# Altium schematic sheet ADC_Signal_Distribution.SchDoc
size A4; CompanyName: Technische Hochschule Nürnberg Georg Simon Ohm; Organization: UltraZohm; Address1: Kesslerplatz 12; Address2: 90489 Nürnberg; Address3: GERMANY; DocumentNumber: 8; SheetNumber: 8; SheetTotal: 12; Website: www.ultrazohm.com
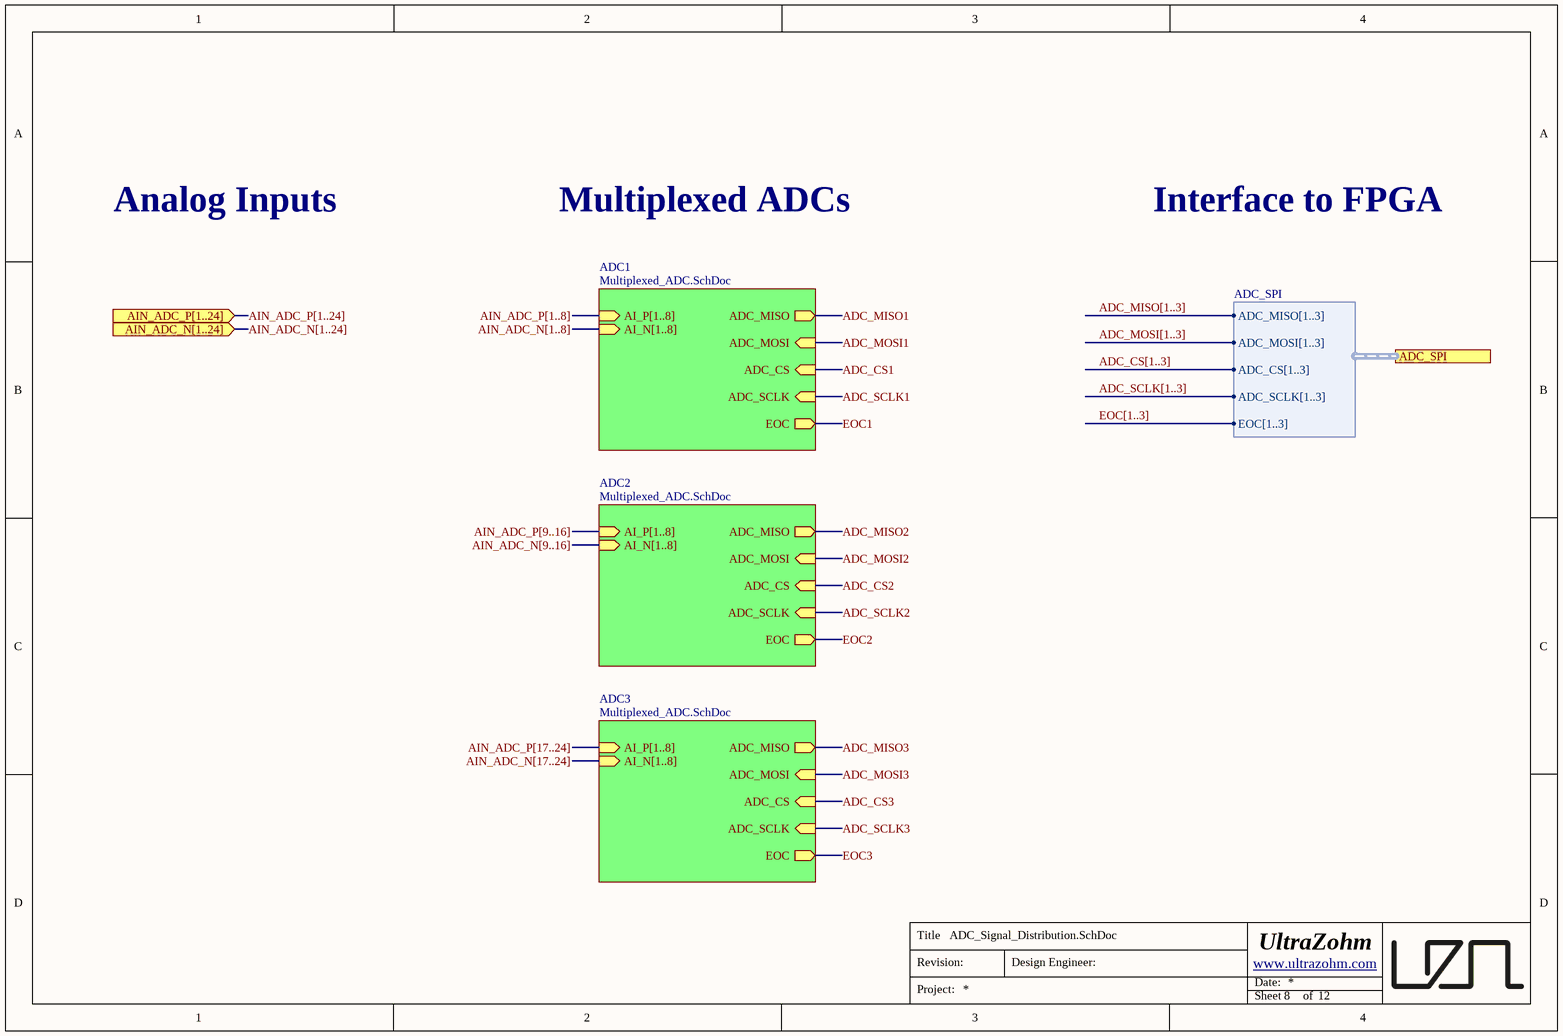
[diagram p0: ADC_Signal_Distribution.SchDoc]

## Sub-sheets
ADC1 = Multiplexed_ADC.SchDoc: ADC_MOSI (in), ADC_CS (in), ADC_SCLK (in), ADC_MISO (out), AI_P[1..8] (in), AI_N[1..8] (in), EOC (out)
ADC2 = Multiplexed_ADC.SchDoc: ADC_MOSI (in), ADC_CS (in), ADC_SCLK (in), ADC_MISO (out), AI_P[1..8] (in), AI_N[1..8] (in), EOC (out)
ADC3 = Multiplexed_ADC.SchDoc: ADC_MOSI (in), ADC_CS (in), ADC_SCLK (in), ADC_MISO (out), AI_P[1..8] (in), AI_N[1..8] (in), EOC (out)

## Ports
ADC_SPI (harness ADC_SPI), AIN_ADC_N[1..24] (in), AIN_ADC_P[1..24] (in)

## Harnesses
ADC_SPI: ADC_MISO[1..3], ADC_MOSI[1..3], ADC_CS[1..3], ADC_SCLK[1..3], EOC[1..3]

## Nets
ADC_CS1: sheet ADC1/ADC_CS
ADC_CS2: sheet ADC2/ADC_CS
ADC_CS3: sheet ADC3/ADC_CS
ADC_MISO1: sheet ADC1/ADC_MISO
ADC_MISO2: sheet ADC2/ADC_MISO
ADC_MISO3: sheet ADC3/ADC_MISO
ADC_MOSI1: sheet ADC1/ADC_MOSI
ADC_MOSI2: sheet ADC2/ADC_MOSI
ADC_MOSI3: sheet ADC3/ADC_MOSI
ADC_SCLK1: sheet ADC1/ADC_SCLK
ADC_SCLK2: sheet ADC2/ADC_SCLK
ADC_SCLK3: sheet ADC3/ADC_SCLK
EOC1: sheet ADC1/EOC
EOC2: sheet ADC2/EOC
EOC3: sheet ADC3/EOC

## Buses and harness runs
bus ADC_CS[1..3]
bus ADC_MISO[1..3]
bus ADC_MOSI[1..3]
bus ADC_SCLK[1..3]
bus AIN_ADC_N[1..8] = sheet ADC1/AI_N[1..8]
bus AIN_ADC_N[1..24] = port AIN_ADC_N[1..24]
bus AIN_ADC_N[9..16] = sheet ADC2/AI_N[1..8]
bus AIN_ADC_N[17..24] = sheet ADC3/AI_N[1..8]
bus AIN_ADC_P[1..8] = sheet ADC1/AI_P[1..8]
bus AIN_ADC_P[1..24] = port AIN_ADC_P[1..24]
bus AIN_ADC_P[9..16] = sheet ADC2/AI_P[1..8]
bus AIN_ADC_P[17..24] = sheet ADC3/AI_P[1..8]
bus EOC[1..3]

## Notes on the sheet
- Analog Inputs
- Multiplexed ADCs
- Interface to FPGA
- Title
- Revision:
- Design Engineer:
- Date:
- Project:
- Sheet
- of